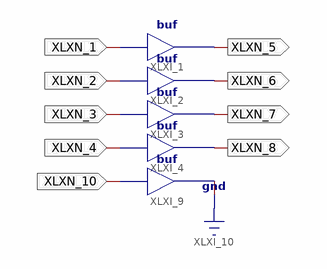
[diagram p0: schematic sheet 1]
// Xilinx ISE schematic lab6.sch (spartan6) as structural Verilog: 5 symbols, 9 ports
module lab6 (
  input  XLXN_1,
  input  XLXN_2,
  input  XLXN_3,
  input  XLXN_4,
  input  XLXN_10,
  output XLXN_5,
  output XLXN_6,
  output XLXN_7,
  output XLXN_8
);

  buf XLXI_1 (XLXN_5, XLXN_1);
  buf XLXI_2 (XLXN_6, XLXN_2);
  buf XLXI_3 (XLXN_7, XLXN_3);
  buf XLXI_4 (XLXN_8, XLXN_4);
  // buf XLXI_9 has open pins: I=XLXN_10, O=1'b0
endmodule
